# Altium schematic sheet 02_Top_Sistema_Hub.SchDoc
size A4; SheetNumber: 5; SheetTotal: 21
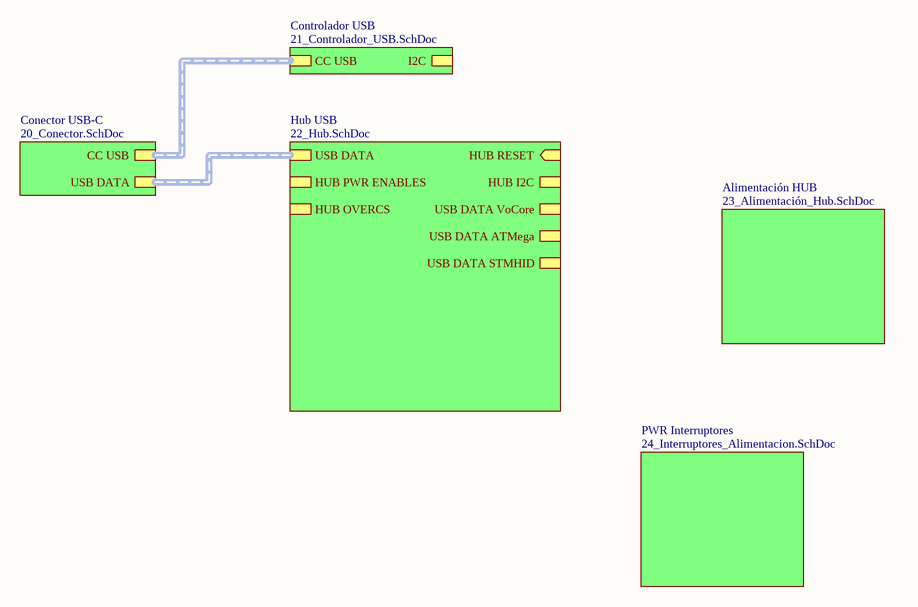
[diagram p0: 02_Top_Sistema_Hub.SchDoc]

## Sub-sheets
Alimentación HUB = 23_Alimentación_Hub.SchDoc: no entries
Conector USB-C = 20_Conector.SchDoc: USB DATA (harness USBD LINK), CC USB (harness CC LINK)
Controlador USB = 21_Controlador_USB.SchDoc: I2C (harness I2C BUS), CC USB (harness CC LINK)
Hub USB = 22_Hub.SchDoc: HUB I2C (harness I2C BUS), HUB RESET (in), HUB PWR ENABLES (harness HUB PWR ENABLES), HUB OVERCS (harness HUB OVERC), USB DATA (harness USBD BUS), USB DATA VoCore (harness USBD BUS), USB DATA ATMega (harness USBD BUS), USB DATA STMHID (harness USBD BUS)
PWR Interruptores = 24_Interruptores_Alimentacion.SchDoc: no entries

## Buses and harness runs
harness sheet Conector USB-C/CC USB = sheet Controlador USB/CC USB
harness sheet Conector USB-C/USB DATA = sheet Hub USB/USB DATA